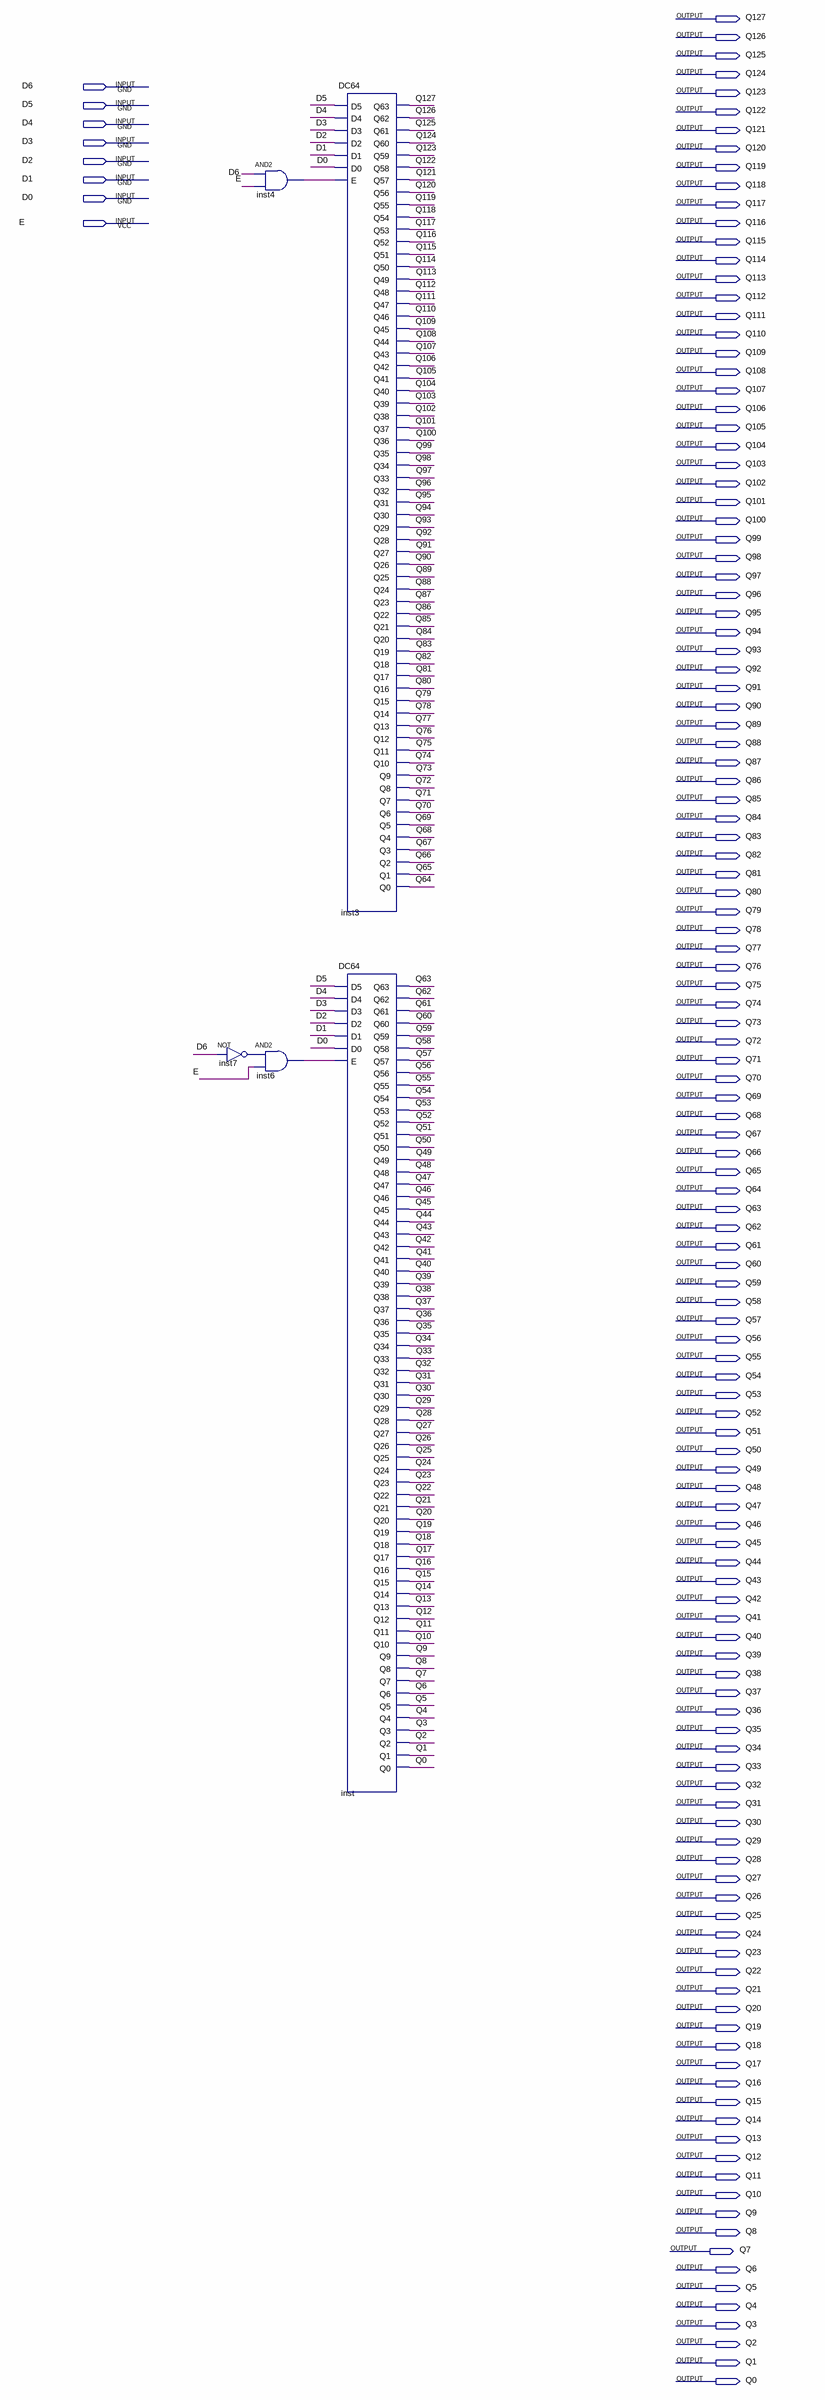
[diagram p0: schematic sheet]
// Quartus schematic DC128.bdf as structural Verilog: 5 symbols, 136 pins
module DC128 (
  input  D6,
  input  D5,
  input  D4,
  input  D3,
  input  D2,
  input  D1,
  input  D0,
  input  E,
  output Q127,
  output Q126,
  output Q125,
  output Q124,
  output Q123,
  output Q122,
  output Q121,
  output Q120,
  output Q119,
  output Q118,
  output Q117,
  output Q116,
  output Q115,
  output Q114,
  output Q113,
  output Q112,
  output Q111,
  output Q110,
  output Q109,
  output Q108,
  output Q107,
  output Q106,
  output Q105,
  output Q104,
  output Q103,
  output Q102,
  output Q101,
  output Q100,
  output Q99,
  output Q98,
  output Q97,
  output Q96,
  output Q95,
  output Q94,
  output Q93,
  output Q92,
  output Q91,
  output Q90,
  output Q89,
  output Q88,
  output Q87,
  output Q86,
  output Q85,
  output Q84,
  output Q83,
  output Q82,
  output Q81,
  output Q80,
  output Q79,
  output Q78,
  output Q77,
  output Q76,
  output Q75,
  output Q74,
  output Q73,
  output Q72,
  output Q71,
  output Q70,
  output Q69,
  output Q68,
  output Q67,
  output Q66,
  output Q65,
  output Q64,
  output Q63,
  output Q62,
  output Q61,
  output Q60,
  output Q59,
  output Q58,
  output Q57,
  output Q56,
  output Q55,
  output Q54,
  output Q53,
  output Q52,
  output Q51,
  output Q50,
  output Q49,
  output Q48,
  output Q47,
  output Q46,
  output Q45,
  output Q44,
  output Q43,
  output Q42,
  output Q41,
  output Q40,
  output Q39,
  output Q38,
  output Q37,
  output Q36,
  output Q35,
  output Q34,
  output Q33,
  output Q32,
  output Q31,
  output Q30,
  output Q29,
  output Q28,
  output Q27,
  output Q26,
  output Q25,
  output Q24,
  output Q23,
  output Q22,
  output Q21,
  output Q20,
  output Q19,
  output Q18,
  output Q17,
  output Q16,
  output Q15,
  output Q14,
  output Q13,
  output Q12,
  output Q11,
  output Q10,
  output Q9,
  output Q8,
  output Q7,
  output Q6,
  output Q5,
  output Q4,
  output Q3,
  output Q2,
  output Q1,
  output Q0
);

  wire inst4_out, inst6_out, inst7_out;

  not inst7 (inst7_out, D6);
  and inst4 (inst4_out, D6, E);
  and inst6 (inst6_out, inst7_out, E);
  DC64 inst3 (
    .D5(D5), .D4(D4), .D3(D3), .D2(D2), .D1(D1), .D0(D0), .E(inst4_out), .Q63(Q127), .Q62(Q126), .Q61(Q125),
    .Q60(Q124), .Q59(Q123), .Q58(Q122), .Q57(Q121), .Q56(Q120), .Q55(Q119), .Q54(Q118), .Q53(Q117),
    .Q52(Q116), .Q51(Q115), .Q50(Q114), .Q49(Q113), .Q48(Q112), .Q47(Q111), .Q46(Q110), .Q45(Q109),
    .Q44(Q108), .Q43(Q107), .Q42(Q106), .Q41(Q105), .Q40(Q104), .Q39(Q103), .Q38(Q102), .Q37(Q101),
    .Q36(Q100), .Q35(Q99), .Q34(Q98), .Q33(Q97), .Q32(Q96), .Q31(Q95), .Q30(Q94), .Q29(Q93), .Q28(Q92),
    .Q27(Q91), .Q26(Q90), .Q25(Q89), .Q24(Q88), .Q23(Q87), .Q22(Q86), .Q21(Q85), .Q20(Q84), .Q19(Q83),
    .Q18(Q82), .Q17(Q81), .Q16(Q80), .Q15(Q79), .Q14(Q78), .Q13(Q77), .Q12(Q76), .Q11(Q75), .Q10(Q74),
    .Q9(Q73), .Q8(Q72), .Q7(Q71), .Q6(Q70), .Q5(Q69), .Q4(Q68), .Q3(Q67), .Q2(Q66), .Q1(Q65), .Q0(Q64));
  DC64 inst (
    .D5(D5), .D4(D4), .D3(D3), .D2(D2), .D1(D1), .D0(D0), .E(inst6_out), .Q63(Q63), .Q62(Q62), .Q61(Q61),
    .Q60(Q60), .Q59(Q59), .Q58(Q58), .Q57(Q57), .Q56(Q56), .Q55(Q55), .Q54(Q54), .Q53(Q53), .Q52(Q52),
    .Q51(Q51), .Q50(Q50), .Q49(Q49), .Q48(Q48), .Q47(Q47), .Q46(Q46), .Q45(Q45), .Q44(Q44), .Q43(Q43),
    .Q42(Q42), .Q41(Q41), .Q40(Q40), .Q39(Q39), .Q38(Q38), .Q37(Q37), .Q36(Q36), .Q35(Q35), .Q34(Q34),
    .Q33(Q33), .Q32(Q32), .Q31(Q31), .Q30(Q30), .Q29(Q29), .Q28(Q28), .Q27(Q27), .Q26(Q26), .Q25(Q25),
    .Q24(Q24), .Q23(Q23), .Q22(Q22), .Q21(Q21), .Q20(Q20), .Q19(Q19), .Q18(Q18), .Q17(Q17), .Q16(Q16),
    .Q15(Q15), .Q14(Q14), .Q13(Q13), .Q12(Q12), .Q11(Q11), .Q10(Q10), .Q9(Q9), .Q8(Q8), .Q7(Q7), .Q6(Q6),
    .Q5(Q5), .Q4(Q4), .Q3(Q3), .Q2(Q2), .Q1(Q1), .Q0(Q0));
endmodule
